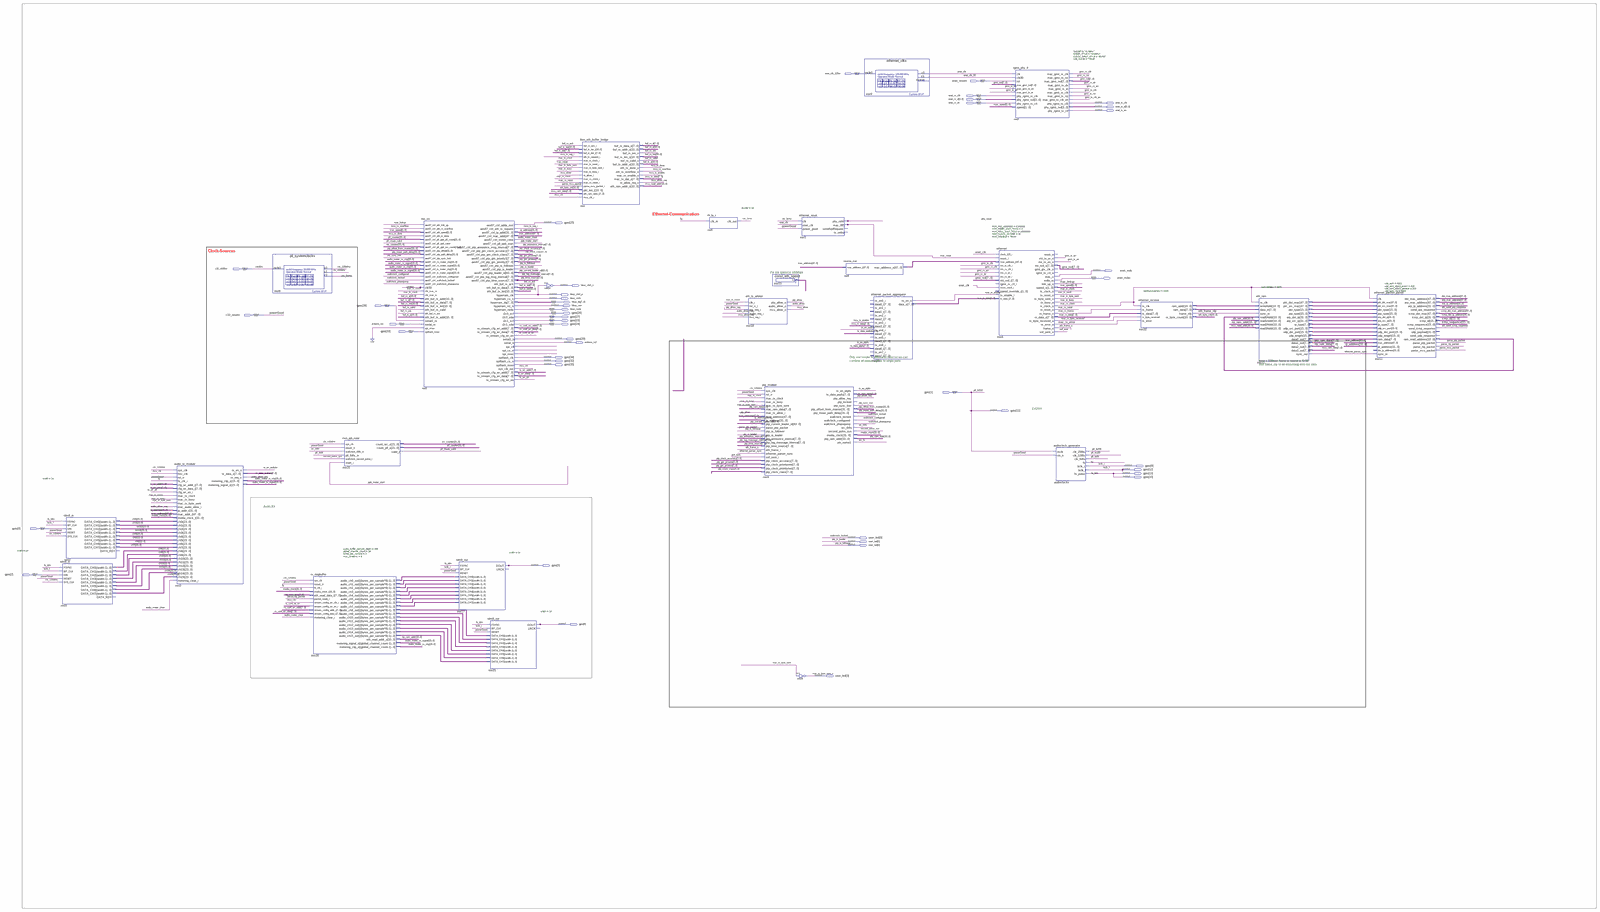
[diagram p0: schematic sheet, whole]
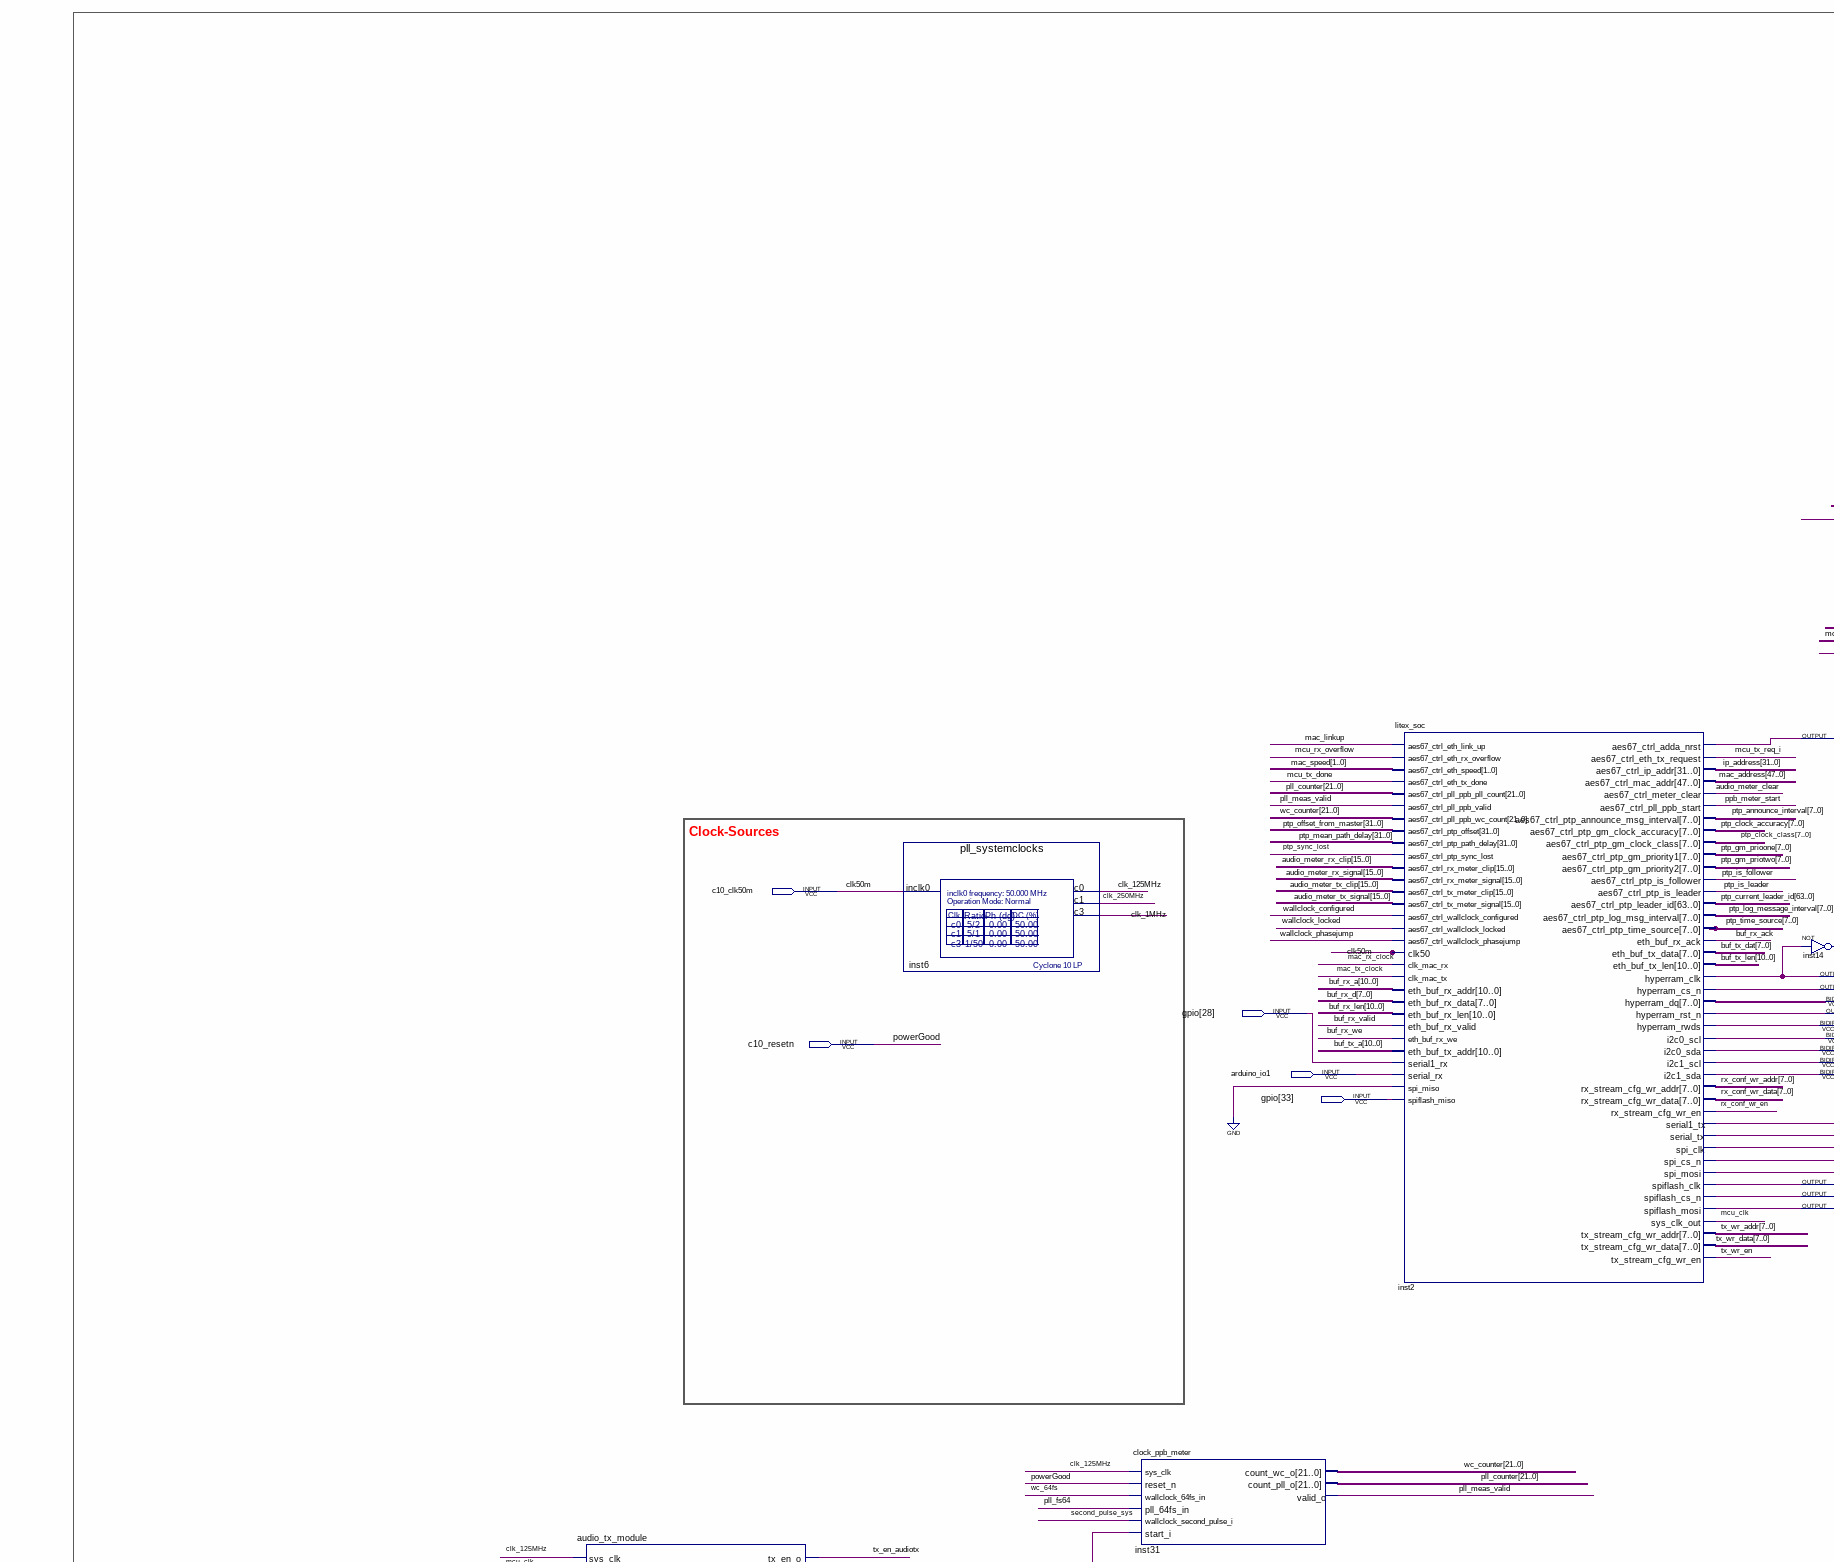
[diagram p1: schematic sheet, upper left part]
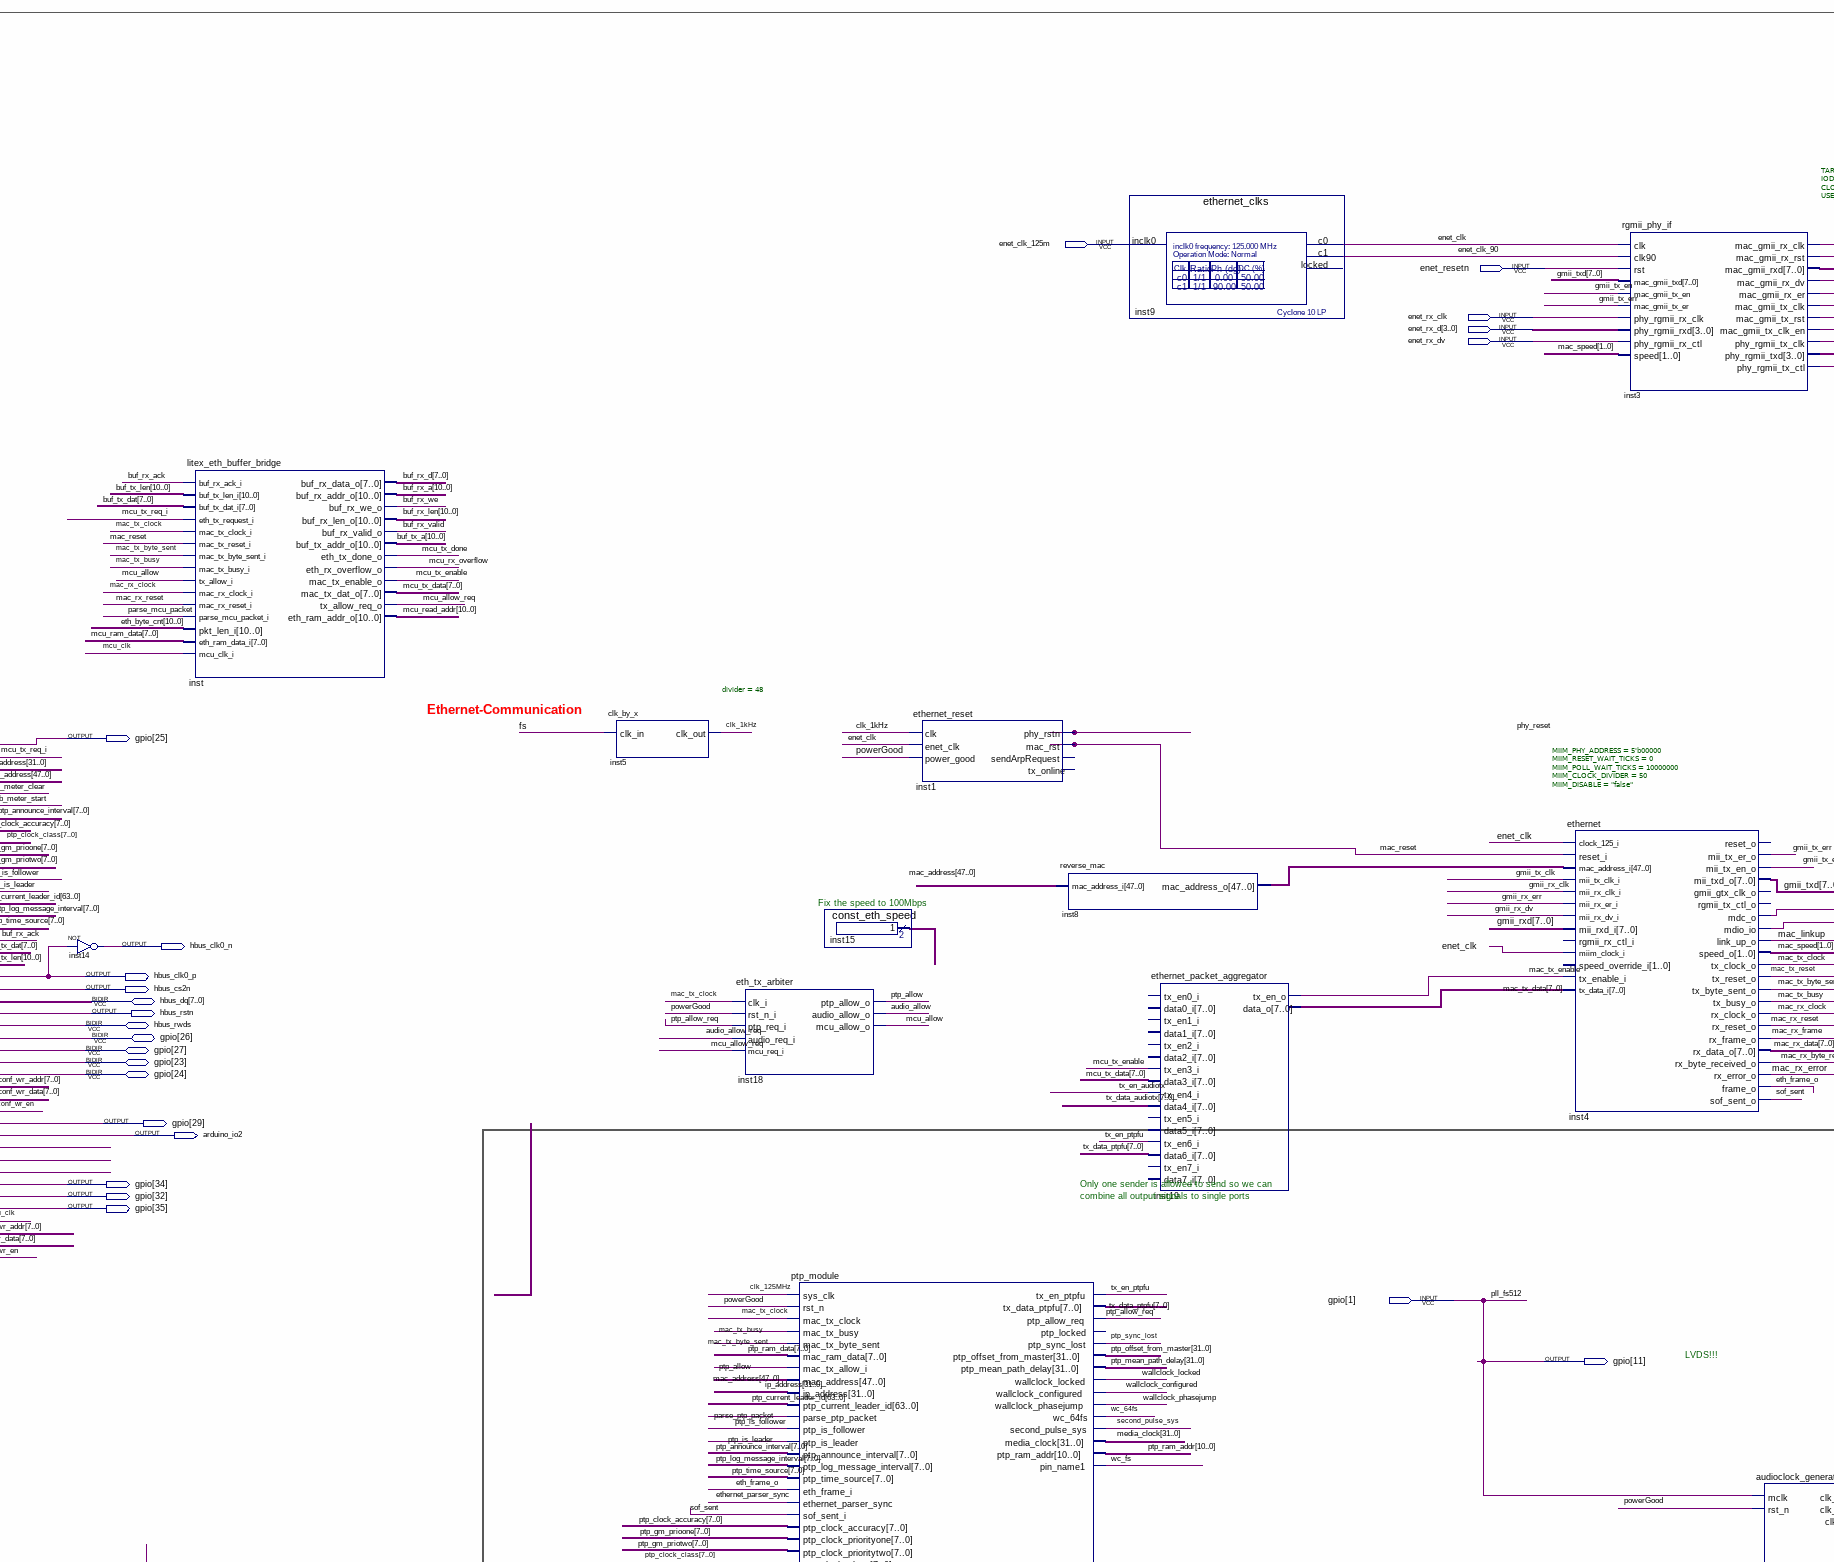
[diagram p2: schematic sheet, upper centre part]
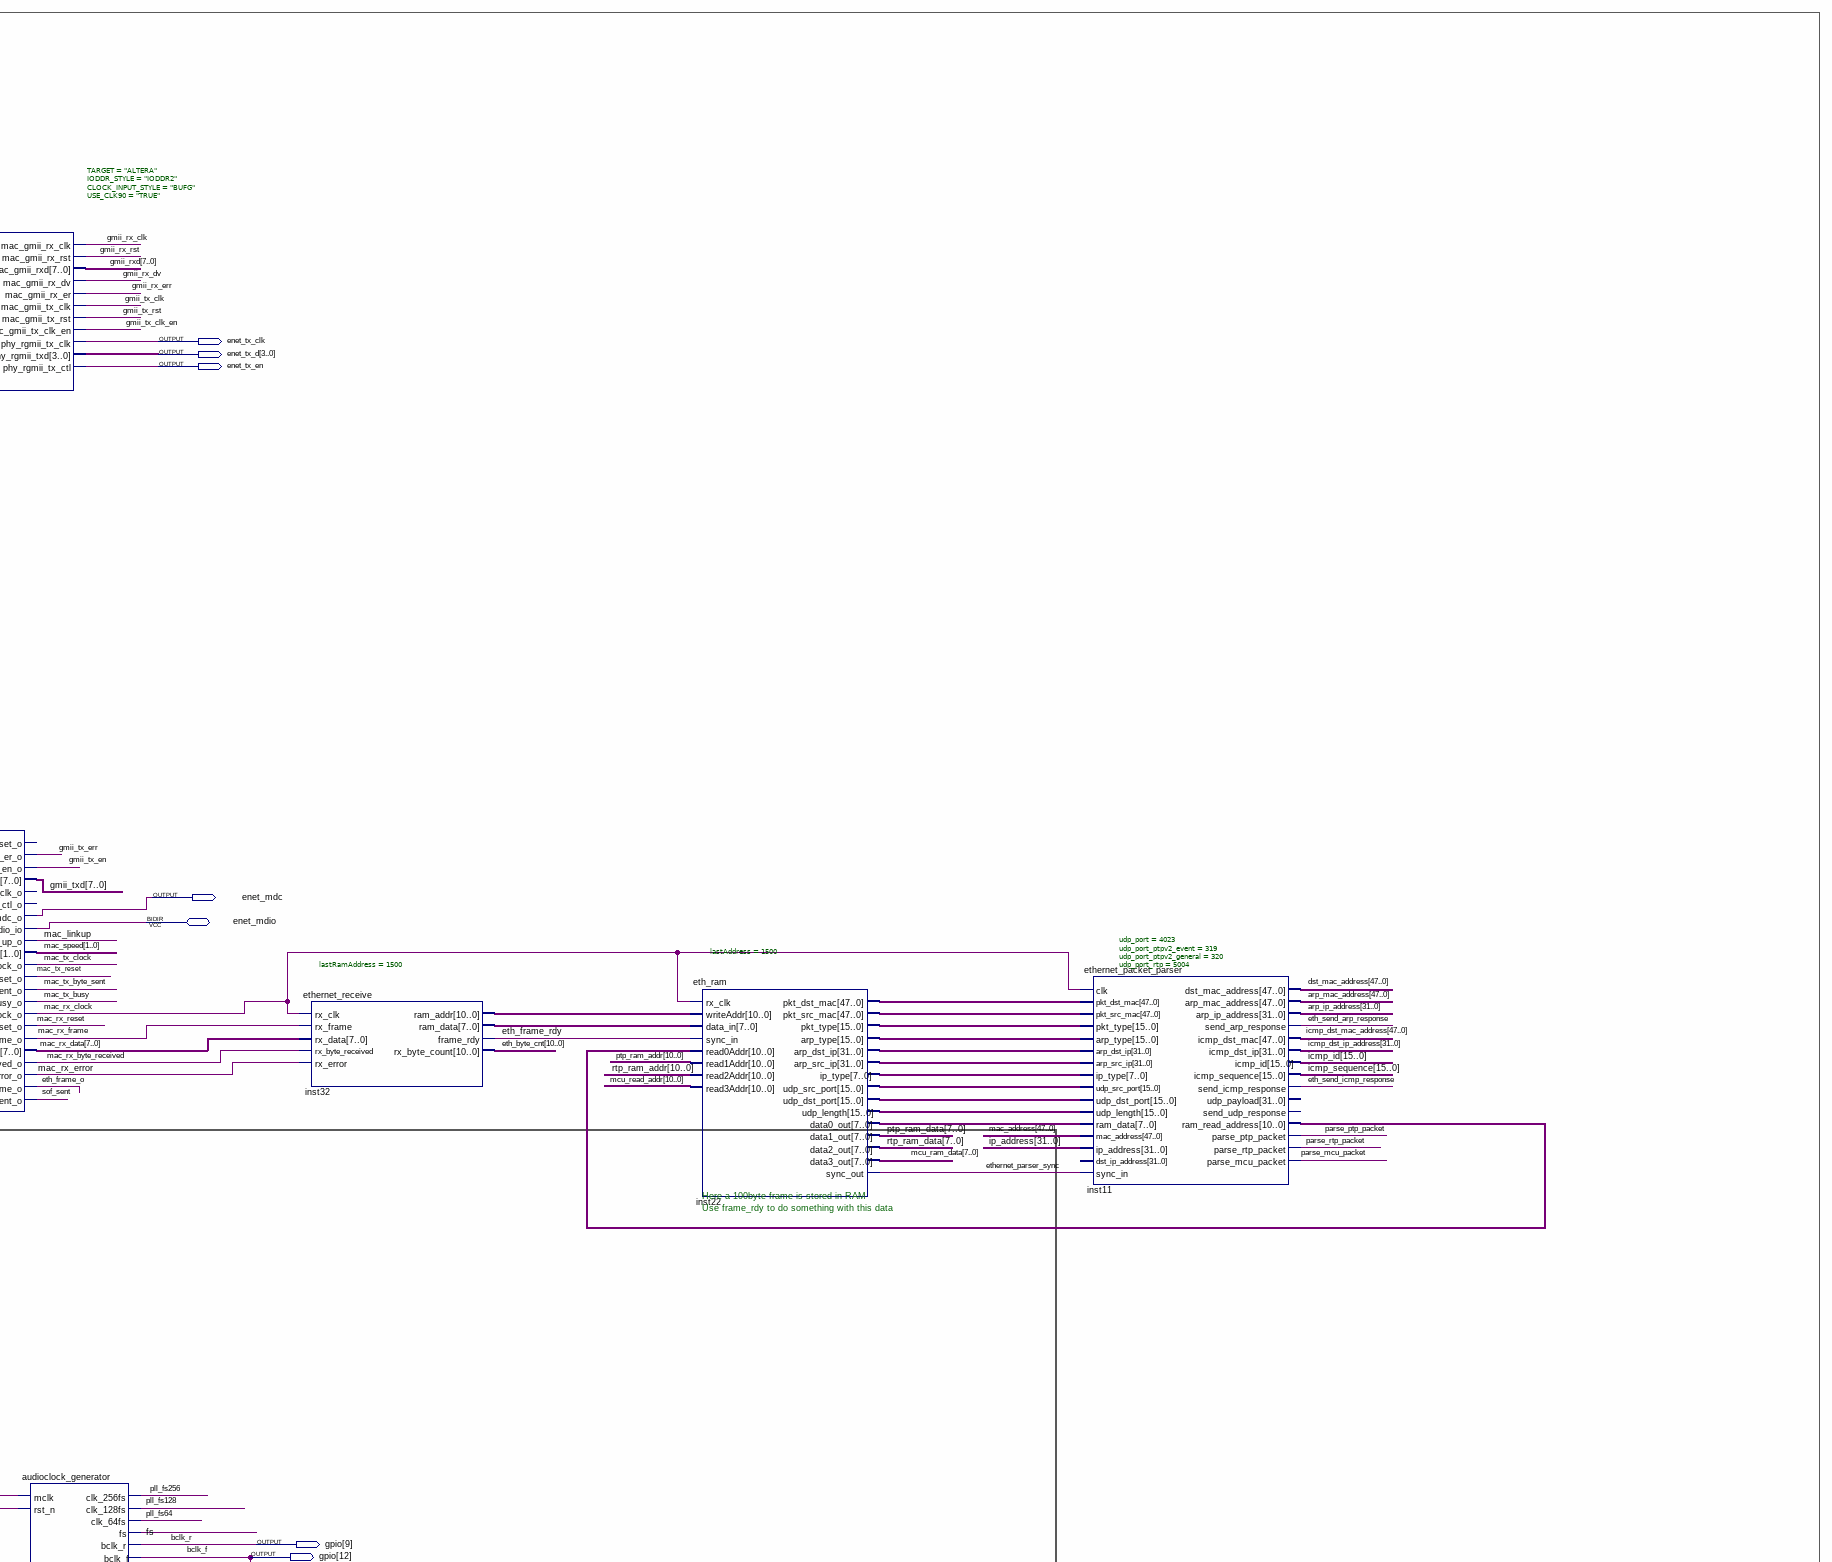
[diagram p3: schematic sheet, upper right part]
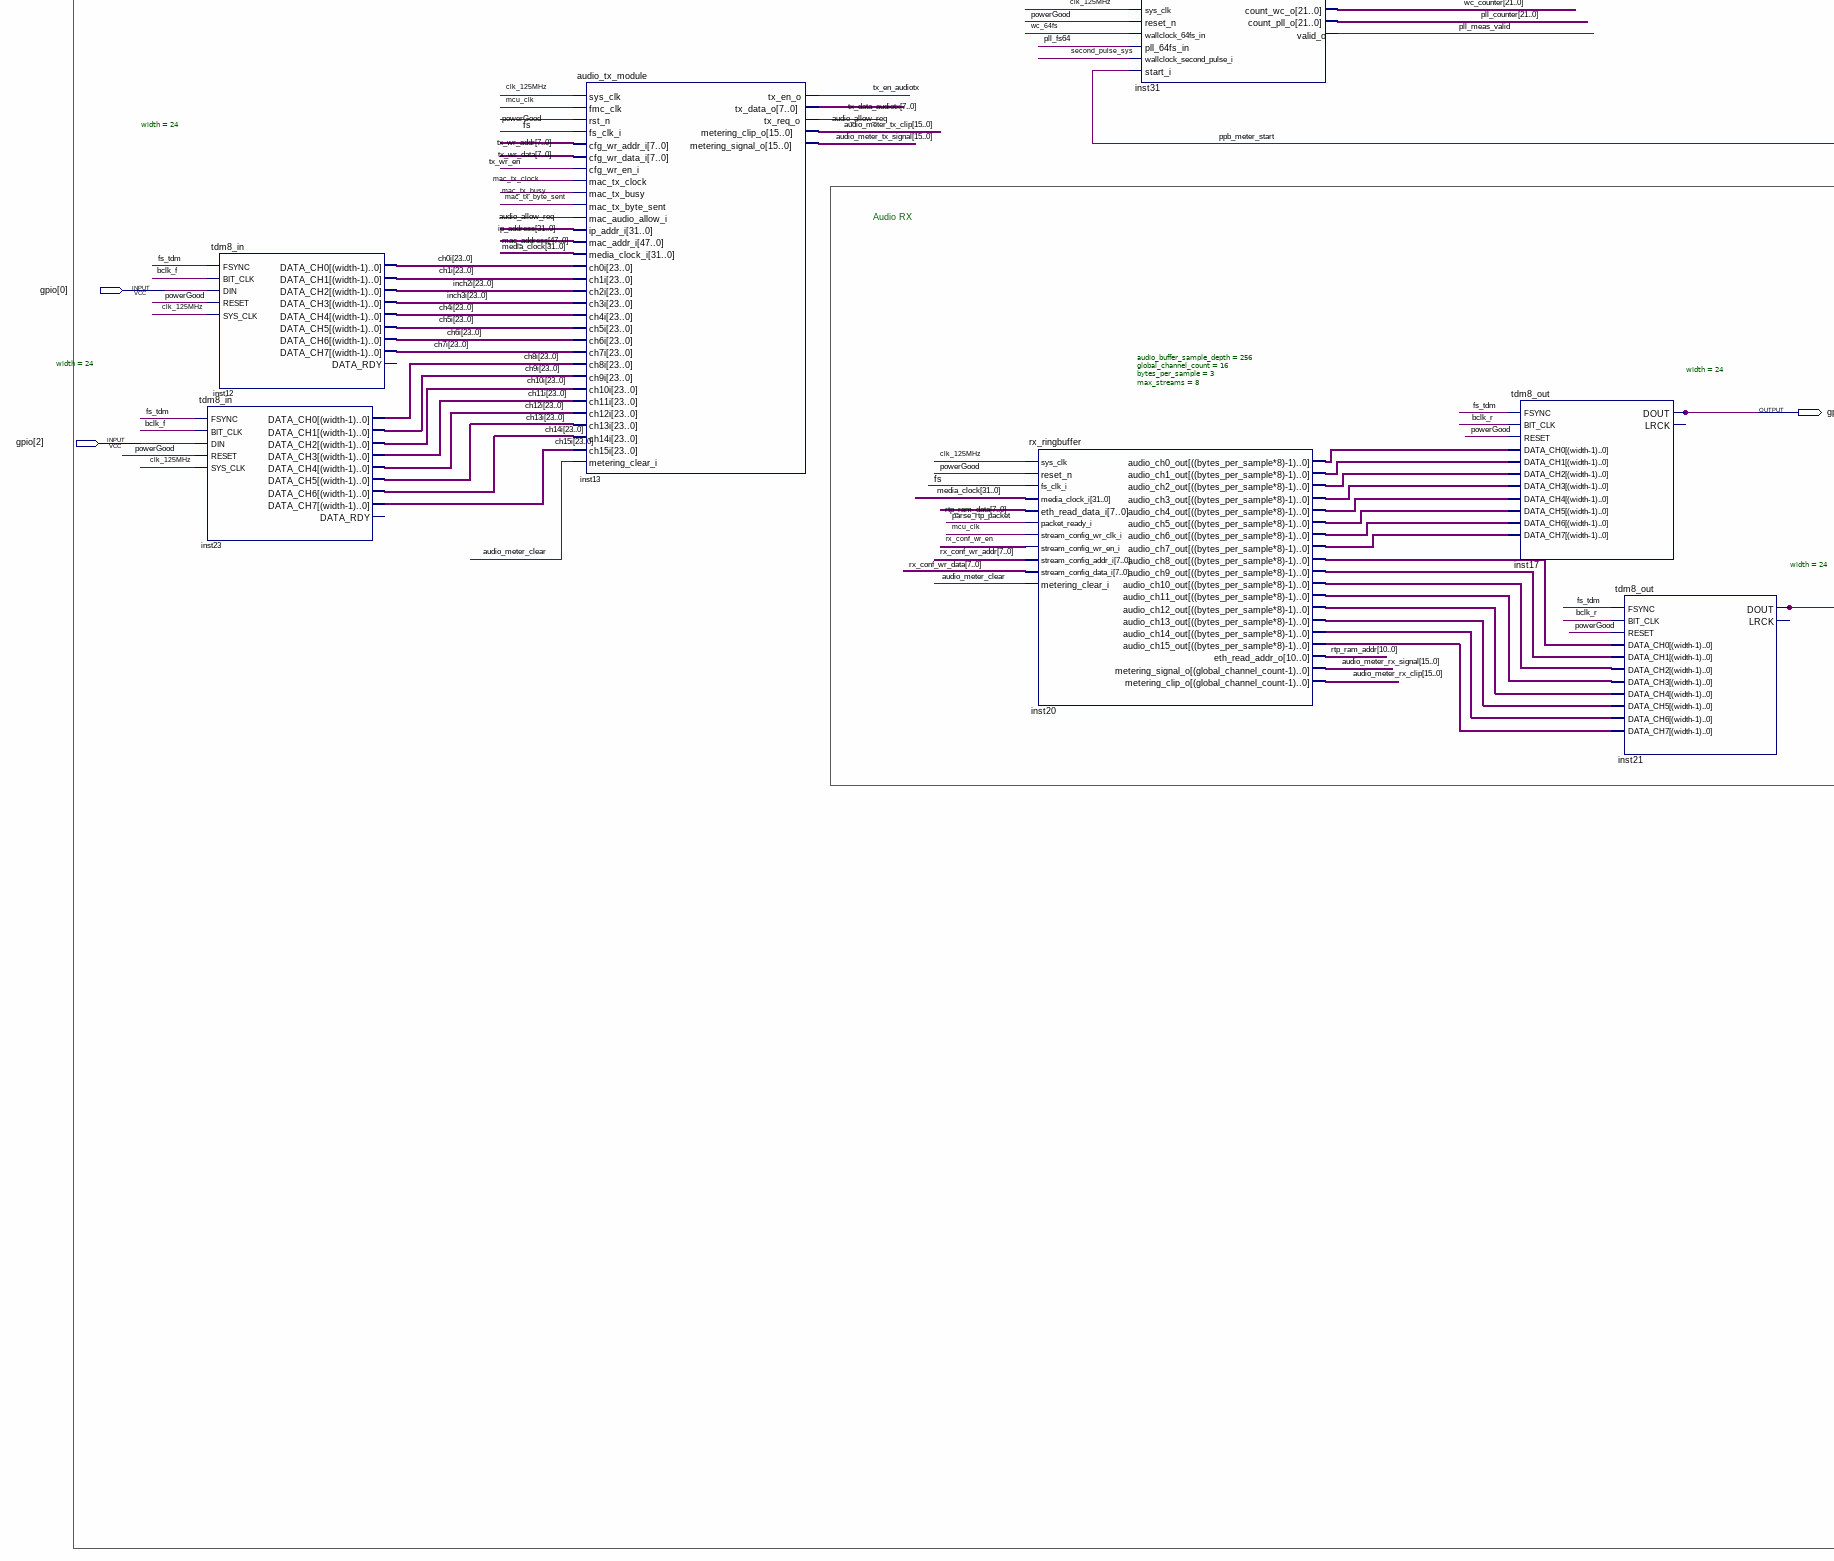
[diagram p4: schematic sheet, lower left part]
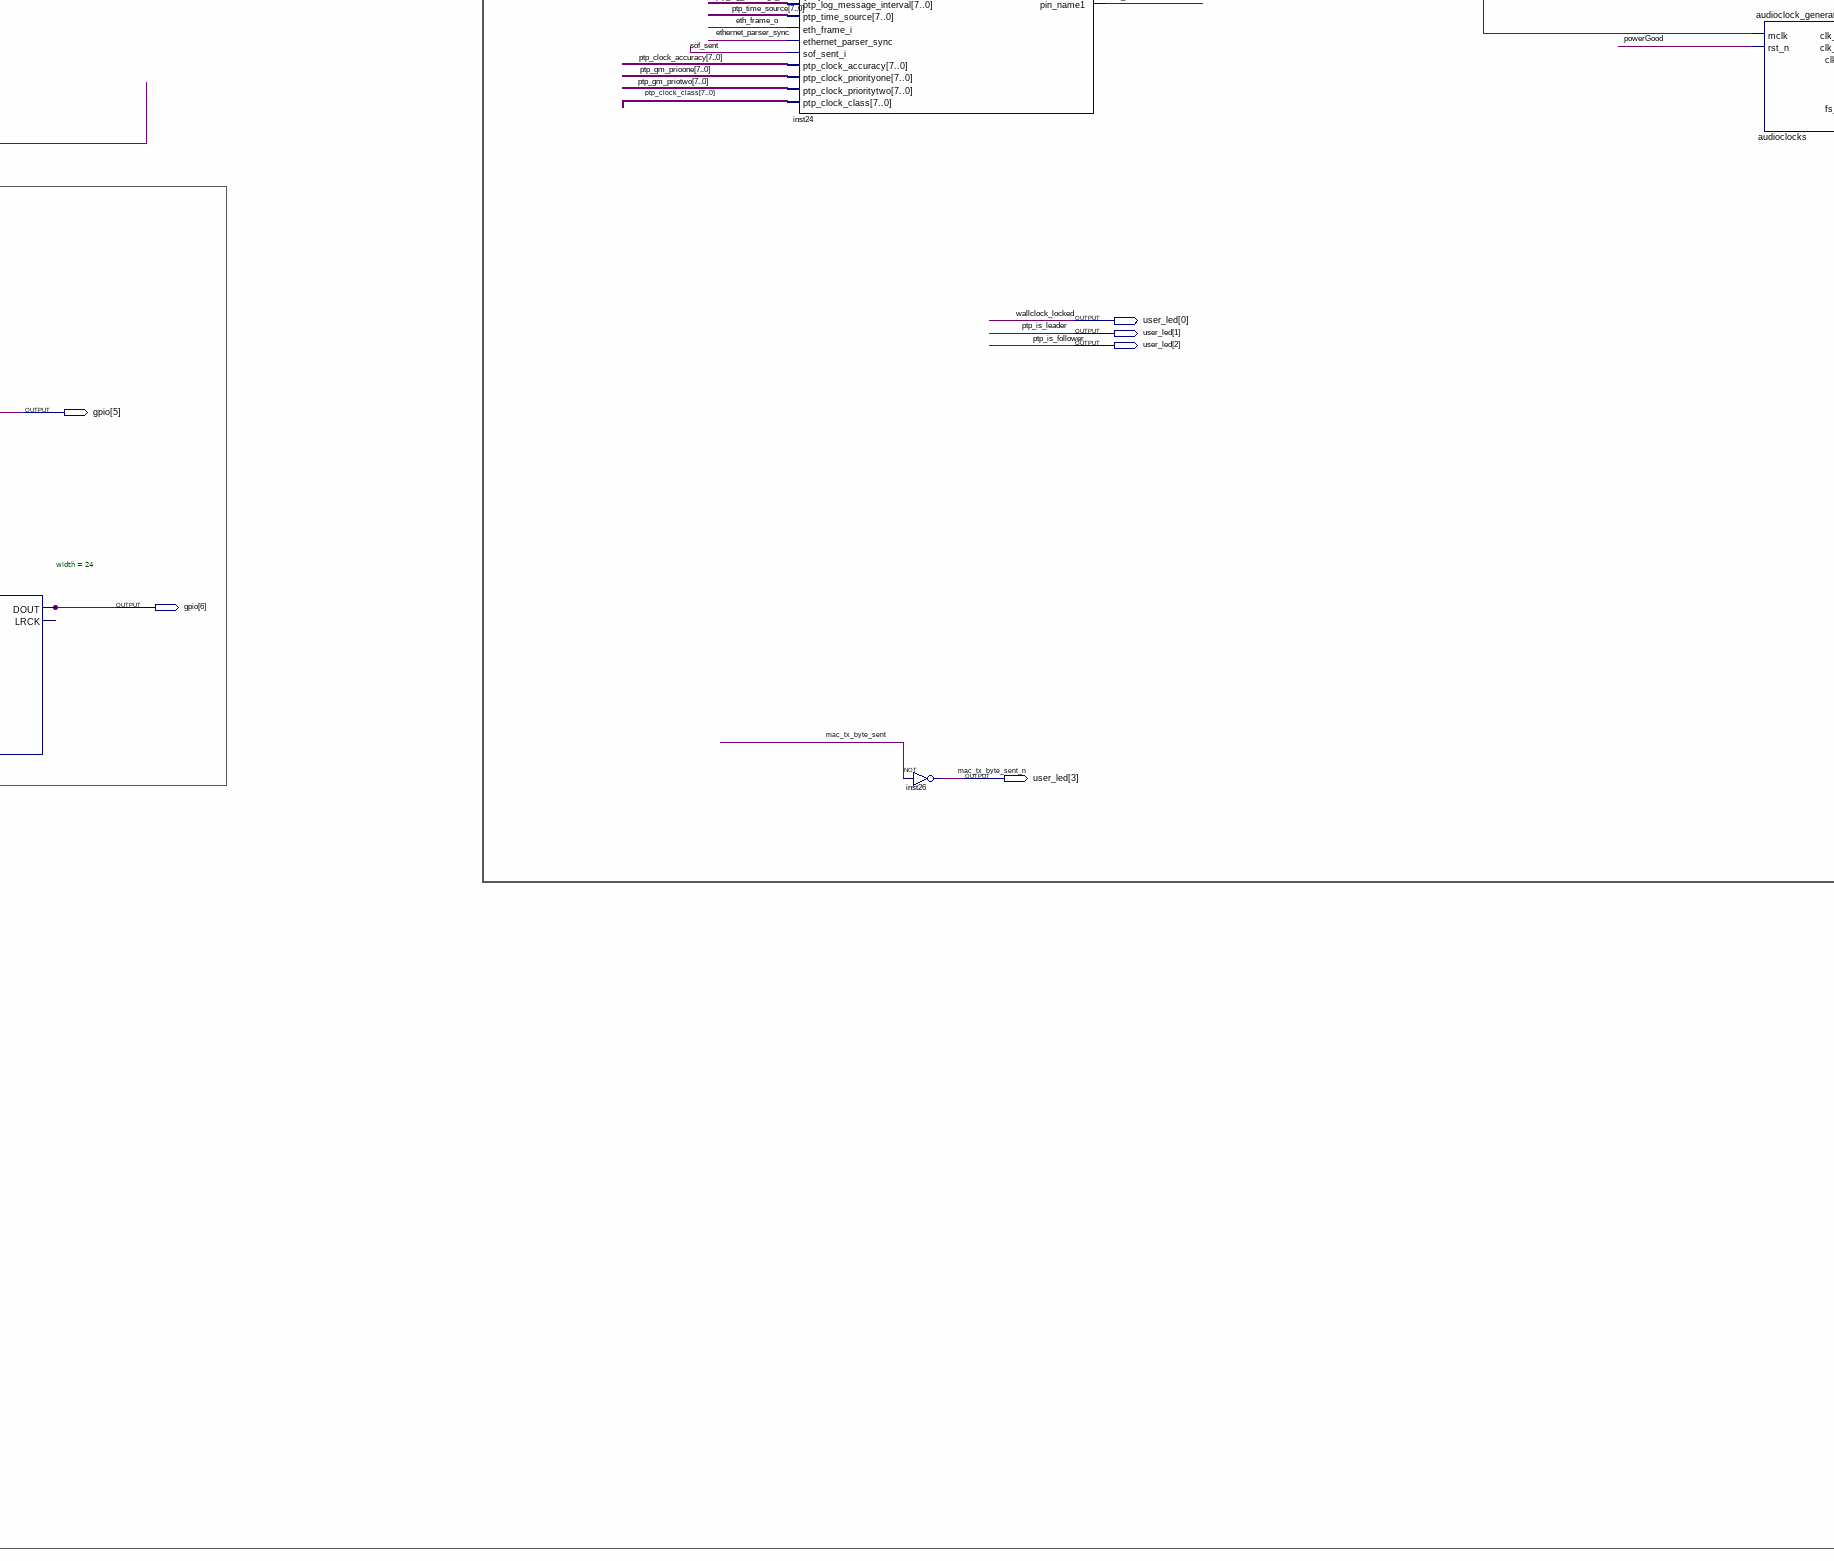
[diagram p5: schematic sheet, lower centre part]
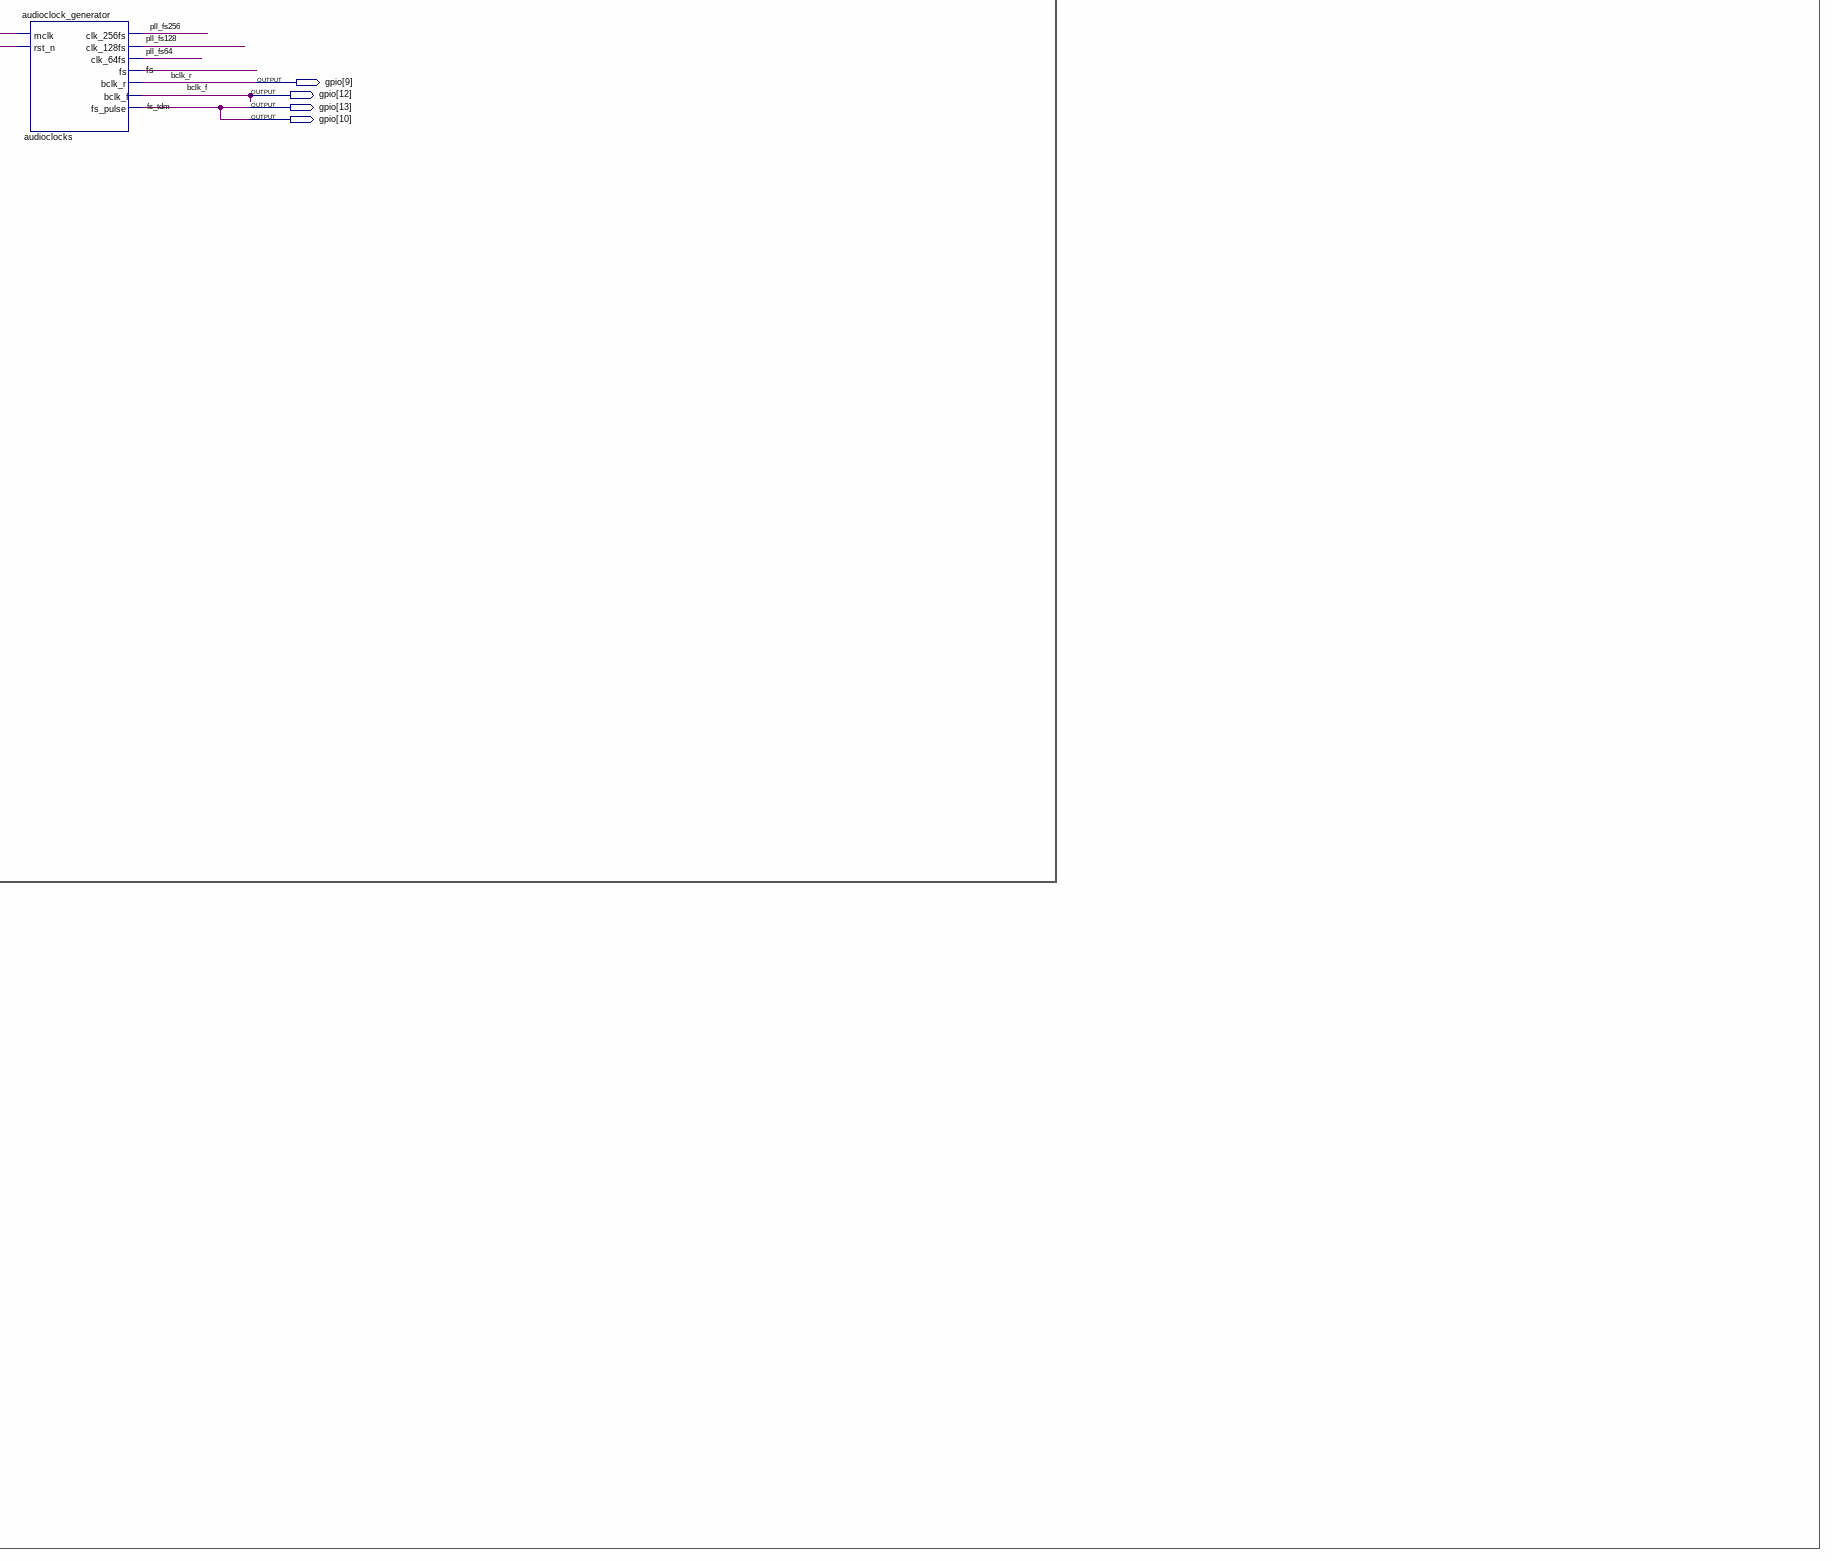
[diagram p6: schematic sheet, lower right part]
// Quartus schematic FPGA.bdf as structural Verilog: 26 symbols, 45 pins
module FPGA (
  input  enet_clk_125m,
  input  enet_resetn,
  input  enet_rx_clk,
  input  [3:0] enet_rx_d,
  input  enet_rx_dv,
  input  c10_clk50m,
  inout  [35:0] gpio,
  input  c10_resetn,
  input  arduino_io1,
  inout  enet_mdio,
  inout  [7:0] hbus_dq,
  inout  hbus_rwds,
  output enet_tx_clk,
  output [3:0] enet_tx_d,
  output enet_tx_en,
  output enet_mdc,
  output hbus_clk0_n,
  output hbus_clk0_p,
  output hbus_cs2n,
  output hbus_rstn,
  output arduino_io2,
  output [3:0] user_led
);

  wire audio_allow, audio_allow_req, audio_meter_clear, buf_rx_ack, buf_rx_valid, buf_rx_we, clk_1kHz,
       clk_1MHz, clk_125MHz, clk_250MHz, enet_clk, enet_clk_90, eth_frame_o, eth_frame_rdy,
       eth_send_arp_response, eth_send_icmp_response, ethernet_parser_sync, fs, gmii_rx_clk, gmii_rx_dv,
       gmii_rx_err, gmii_rx_rst, gmii_tx_clk, gmii_tx_clk_en, gmii_tx_en, gmii_tx_err, gmii_tx_rst,
       inst2_spi_clk, inst2_spi_cs_n, inst2_spi_mosi, mac_linkup, mac_reset, mac_rx_byte_received,
       mac_rx_clock, mac_rx_error, mac_rx_frame, mac_rx_reset, mac_tx_busy, mac_tx_byte_sent, mac_tx_clock,
       mac_tx_enable, mac_tx_reset, mcu_allow, mcu_allow_req, mcu_clk, mcu_rx_overflow, mcu_tx_done,
       mcu_tx_enable, mcu_tx_req_i, parse_mcu_packet, parse_ptp_packet, parse_rtp_packet, phy_reset,
       pll_fs64, pll_fs128, pll_fs256, pll_meas_valid, ppb_meter_start, ptp_allow, ptp_allow_req,
       ptp_sync_lost, rx_conf_wr_en, second_pulse_sys, sof_sent, tx_en_audiotx, tx_en_ptpfu, tx_wr_en,
       wallclock_configured, wallclock_phasejump, wc_64fs, wc_fs;
  wire [1:0] inst15_result, mac_speed;
  wire [7:0] buf_rx_d, buf_tx_dat, gmii_rxd, gmii_txd, inst22_data0_out, inst22_ip_type, inst32_ram_data,
       mac_rx_data, mac_tx_data, mcu_ram_data, mcu_tx_data, ptp_announce_interval, ptp_clock_accuracy,
       ptp_clock_class, ptp_gm_prioone, ptp_gm_priotwo, ptp_log_message_interval, ptp_ram_data,
       ptp_time_source, rtp_ram_data, rx_conf_wr_addr, rx_conf_wr_data, tx_data_audiotx, tx_data_ptpfu,
       tx_wr_addr, tx_wr_data;
  wire [10:0] buf_rx_a, buf_rx_len, buf_tx_a, buf_tx_len, eth_byte_cnt, inst11_ram_read_address,
       inst32_ram_addr, mcu_read_addr, ptp_ram_addr, rtp_ram_addr;
  wire [15:0] audio_meter_rx_clip, audio_meter_rx_signal, audio_meter_tx_clip, audio_meter_tx_signal,
       icmp_id, icmp_sequence, inst22_arp_type, inst22_pkt_type, inst22_udp_dst_port, inst22_udp_length,
       inst22_udp_src_port;
  wire [21:0] pll_counter, wc_counter;
  wire [23:0] ch0i, ch1i, ch4i, ch5i, ch6i, ch7i, ch8i, ch9i, ch10i, ch11i, ch12i, ch13i, ch14i, ch15i,
       inch2i, inch3i, inst20_audio_ch0_out, inst20_audio_ch1_out, inst20_audio_ch2_out,
       inst20_audio_ch3_out, inst20_audio_ch4_out, inst20_audio_ch5_out, inst20_audio_ch6_out,
       inst20_audio_ch7_out, inst20_audio_ch8_out, inst20_audio_ch9_out, inst20_audio_ch10_out,
       inst20_audio_ch11_out, inst20_audio_ch12_out, inst20_audio_ch13_out, inst20_audio_ch14_out,
       inst20_audio_ch15_out;
  wire [31:0] arp_ip_address, icmp_dst_ip_address, inst22_arp_dst_ip, inst22_arp_src_ip, ip_address,
       media_clock, ptp_mean_path_delay, ptp_offset_from_master;
  wire [47:0] arp_mac_address, dst_mac_address, icmp_dst_mac_address, inst8_mac_address_o,
       inst22_pkt_dst_mac, inst22_pkt_src_mac, mac_address;
  wire [63:0] ptp_current_leader_id;

  tdm8_in #(.width(24)) inst12 (
    .FSYNC(gpio[13]), .BIT_CLK(gpio[12]), .DIN(gpio[0]), .RESET(c10_resetn), .SYS_CLK(clk_125MHz),
    .DATA_CH0(ch0i), .DATA_CH1(ch1i), .DATA_CH2(inch2i), .DATA_CH3(inch3i), .DATA_CH4(ch4i), .DATA_CH5(ch5i),
    .DATA_CH6(ch6i), .DATA_CH7(ch7i));  // open: DATA_RDY
  tdm8_in #(.width(24)) inst23 (
    .FSYNC(gpio[13]), .BIT_CLK(gpio[12]), .DIN(gpio[2]), .RESET(c10_resetn), .SYS_CLK(clk_125MHz),
    .DATA_CH0(ch8i), .DATA_CH1(ch9i), .DATA_CH2(ch10i), .DATA_CH3(ch11i), .DATA_CH4(ch12i), .DATA_CH5(ch13i),
    .DATA_CH6(ch14i), .DATA_CH7(ch15i));  // open: DATA_RDY
  audio_tx_module inst13 (
    .sys_clk(clk_125MHz), .fmc_clk(mcu_clk), .rst_n(c10_resetn), .fs_clk_i(fs), .cfg_wr_addr_i(tx_wr_addr),
    .cfg_wr_data_i(tx_wr_data), .cfg_wr_en_i(tx_wr_en), .mac_tx_clock(mac_tx_clock),
    .mac_tx_busy(mac_tx_busy), .mac_tx_byte_sent(mac_tx_byte_sent), .mac_audio_allow_i(audio_allow_req),
    .ip_addr_i(ip_address), .mac_addr_i(mac_address), .media_clock_i(media_clock), .ch0i(ch0i), .ch1i(ch1i),
    .ch2i(inch2i), .ch3i(inch3i), .ch4i(ch4i), .ch5i(ch5i), .ch6i(ch6i), .ch7i(ch7i), .ch8i(ch8i),
    .ch9i(ch9i), .ch10i(ch10i), .ch11i(ch11i), .ch12i(ch12i), .ch13i(ch13i), .ch14i(ch14i), .ch15i(ch15i),
    .metering_clear_i(audio_meter_clear), .tx_en_o(tx_en_audiotx), .tx_data_o(tx_data_audiotx),
    .tx_req_o(audio_allow_req), .metering_clip_o(audio_meter_tx_clip),
    .metering_signal_o(audio_meter_tx_signal));
  pll_systemclocks inst6 (.inclk0(c10_clk50m), .c0(clk_125MHz), .c1(clk_250MHz), .c3(clk_1MHz));
  rx_ringbuffer #(.audio_buffer_sample_depth(256), .global_channel_count(16), .bytes_per_sample(3), .max_streams(8)) inst20 (
    .sys_clk(clk_125MHz), .reset_n(c10_resetn), .fs_clk_i(fs), .media_clock_i(media_clock),
    .eth_read_data_i(rtp_ram_data), .packet_ready_i(parse_rtp_packet), .stream_config_wr_clk_i(mcu_clk),
    .stream_config_wr_en_i(rx_conf_wr_en), .stream_config_addr_i(rx_conf_wr_addr),
    .stream_config_data_i(rx_conf_wr_data), .metering_clear_i(audio_meter_clear),
    .audio_ch0_out(inst20_audio_ch0_out), .audio_ch1_out(inst20_audio_ch1_out),
    .audio_ch2_out(inst20_audio_ch2_out), .audio_ch3_out(inst20_audio_ch3_out),
    .audio_ch4_out(inst20_audio_ch4_out), .audio_ch5_out(inst20_audio_ch5_out),
    .audio_ch6_out(inst20_audio_ch6_out), .audio_ch7_out(inst20_audio_ch7_out),
    .audio_ch8_out(inst20_audio_ch8_out), .audio_ch9_out(inst20_audio_ch9_out),
    .audio_ch10_out(inst20_audio_ch10_out), .audio_ch11_out(inst20_audio_ch11_out),
    .audio_ch12_out(inst20_audio_ch12_out), .audio_ch13_out(inst20_audio_ch13_out),
    .audio_ch14_out(inst20_audio_ch14_out), .audio_ch15_out(inst20_audio_ch15_out),
    .eth_read_addr_o(rtp_ram_addr), .metering_signal_o(audio_meter_rx_signal),
    .metering_clip_o(audio_meter_rx_clip));
  clock_ppb_meter inst31 (
    .sys_clk(clk_125MHz), .reset_n(c10_resetn), .wallclock_64fs_in(wc_64fs), .pll_64fs_in(pll_fs64),
    .wallclock_second_pulse_i(second_pulse_sys), .start_i(ppb_meter_start), .count_wc_o(wc_counter),
    .count_pll_o(pll_counter), .valid_o(pll_meas_valid));
  litex_soc inst2 (
    .aes67_ctrl_eth_link_up(mac_linkup), .aes67_ctrl_eth_rx_overflow(mcu_rx_overflow),
    .aes67_ctrl_eth_speed(mac_speed), .aes67_ctrl_eth_tx_done(mcu_tx_done),
    .aes67_ctrl_pll_ppb_pll_count(pll_counter), .aes67_ctrl_pll_ppb_valid(pll_meas_valid),
    .aes67_ctrl_pll_ppb_wc_count(wc_counter), .aes67_ctrl_ptp_offset(ptp_offset_from_master),
    .aes67_ctrl_ptp_path_delay(ptp_mean_path_delay), .aes67_ctrl_ptp_sync_lost(ptp_sync_lost),
    .aes67_ctrl_rx_meter_clip(audio_meter_rx_clip), .aes67_ctrl_rx_meter_signal(audio_meter_rx_signal),
    .aes67_ctrl_tx_meter_clip(audio_meter_tx_clip), .aes67_ctrl_tx_meter_signal(audio_meter_tx_signal),
    .aes67_ctrl_wallclock_configured(wallclock_configured), .aes67_ctrl_wallclock_locked(user_led[0]),
    .aes67_ctrl_wallclock_phasejump(wallclock_phasejump), .clk50(c10_clk50m), .clk_mac_rx(mac_rx_clock),
    .clk_mac_tx(mac_tx_clock), .eth_buf_rx_addr(buf_rx_a), .eth_buf_rx_data(buf_rx_d),
    .eth_buf_rx_len(buf_rx_len), .eth_buf_rx_valid(buf_rx_valid), .eth_buf_rx_we(buf_rx_we),
    .eth_buf_tx_addr(buf_tx_a), .serial1_rx(gpio[28]), .serial_rx(arduino_io1), .spi_miso(1'b0),
    .spiflash_miso(gpio[33]), .aes67_ctrl_adda_nrst(gpio[25]), .aes67_ctrl_eth_tx_request(mcu_tx_req_i),
    .aes67_ctrl_ip_addr(ip_address), .aes67_ctrl_mac_addr(mac_address),
    .aes67_ctrl_meter_clear(audio_meter_clear), .aes67_ctrl_pll_ppb_start(ppb_meter_start),
    .aes67_ctrl_ptp_announce_msg_interval(ptp_announce_interval),
    .aes67_ctrl_ptp_gm_clock_accuracy(ptp_clock_accuracy), .aes67_ctrl_ptp_gm_clock_class(ptp_clock_class),
    .aes67_ctrl_ptp_gm_priority1(ptp_gm_prioone), .aes67_ctrl_ptp_gm_priority2(ptp_gm_priotwo),
    .aes67_ctrl_ptp_is_follower(user_led[2]), .aes67_ctrl_ptp_is_leader(user_led[1]),
    .aes67_ctrl_ptp_leader_id(ptp_current_leader_id),
    .aes67_ctrl_ptp_log_msg_interval(ptp_log_message_interval), .aes67_ctrl_ptp_time_source(ptp_time_source),
    .eth_buf_rx_ack(buf_rx_ack), .eth_buf_tx_data(buf_tx_dat), .eth_buf_tx_len(buf_tx_len),
    .hyperram_clk(hbus_clk0_p), .hyperram_cs_n(hbus_cs2n), .hyperram_rst_n(hbus_rstn),
    .rx_stream_cfg_wr_addr(rx_conf_wr_addr), .rx_stream_cfg_wr_data(rx_conf_wr_data),
    .rx_stream_cfg_wr_en(rx_conf_wr_en), .serial1_tx(gpio[29]), .serial_tx(arduino_io2),
    .spi_clk(inst2_spi_clk), .spi_cs_n(inst2_spi_cs_n), .spi_mosi(inst2_spi_mosi), .spiflash_clk(gpio[34]),
    .spiflash_cs_n(gpio[32]), .spiflash_mosi(gpio[35]), .sys_clk_out(mcu_clk),
    .tx_stream_cfg_wr_addr(tx_wr_addr), .tx_stream_cfg_wr_data(tx_wr_data), .tx_stream_cfg_wr_en(tx_wr_en),
    .hyperram_dq(hbus_dq), .hyperram_rwds(hbus_rwds), .i2c0_scl(gpio[26]), .i2c0_sda(gpio[27]),
    .i2c1_scl(gpio[23]), .i2c1_sda(gpio[24]));
  tdm8_out #(.width(24)) inst17 (
    .FSYNC(gpio[13]), .BIT_CLK(gpio[9]), .RESET(c10_resetn), .DATA_CH0(inst20_audio_ch0_out),
    .DATA_CH1(inst20_audio_ch1_out), .DATA_CH2(inst20_audio_ch2_out), .DATA_CH3(inst20_audio_ch3_out),
    .DATA_CH4(inst20_audio_ch4_out), .DATA_CH5(inst20_audio_ch5_out), .DATA_CH6(inst20_audio_ch6_out),
    .DATA_CH7(inst20_audio_ch7_out), .DOUT(gpio[5]));  // open: LRCK
  tdm8_out #(.width(24)) inst21 (
    .FSYNC(gpio[13]), .BIT_CLK(gpio[9]), .RESET(c10_resetn), .DATA_CH0(inst20_audio_ch8_out),
    .DATA_CH1(inst20_audio_ch9_out), .DATA_CH2(inst20_audio_ch10_out), .DATA_CH3(inst20_audio_ch11_out),
    .DATA_CH4(inst20_audio_ch12_out), .DATA_CH5(inst20_audio_ch13_out), .DATA_CH6(inst20_audio_ch14_out),
    .DATA_CH7(inst20_audio_ch15_out), .DOUT(gpio[6]));  // open: LRCK
  not inst14 (hbus_clk0_n, hbus_clk0_p);
  litex_eth_buffer_bridge inst (
    .buf_rx_ack_i(buf_rx_ack), .buf_tx_len_i(buf_tx_len), .buf_tx_dat_i(buf_tx_dat),
    .eth_tx_request_i(mcu_tx_req_i), .mac_tx_clock_i(mac_tx_clock), .mac_tx_reset_i(mac_reset),
    .mac_tx_byte_sent_i(mac_tx_byte_sent), .mac_tx_busy_i(mac_tx_busy), .tx_allow_i(mcu_allow),
    .mac_rx_clock_i(mac_rx_clock), .mac_rx_reset_i(mac_rx_reset), .parse_mcu_packet_i(parse_mcu_packet),
    .pkt_len_i(eth_byte_cnt), .eth_ram_data_i(mcu_ram_data), .mcu_clk_i(mcu_clk), .buf_rx_data_o(buf_rx_d),
    .buf_rx_addr_o(buf_rx_a), .buf_rx_we_o(buf_rx_we), .buf_rx_len_o(buf_rx_len),
    .buf_rx_valid_o(buf_rx_valid), .buf_tx_addr_o(buf_tx_a), .eth_tx_done_o(mcu_tx_done),
    .eth_rx_overflow_o(mcu_rx_overflow), .mac_tx_enable_o(mcu_tx_enable), .mac_tx_dat_o(mcu_tx_data),
    .tx_allow_req_o(mcu_allow_req), .eth_ram_addr_o(mcu_read_addr));
  clk_by_x #(.divider(48)) inst5 (.clk_in(fs), .clk_out(clk_1kHz));
  eth_tx_arbiter inst18 (
    .clk_i(mac_tx_clock), .rst_n_i(c10_resetn), .ptp_req_i(ptp_allow_req), .audio_req_i(audio_allow_req),
    .mcu_req_i(mcu_allow_req), .ptp_allow_o(ptp_allow), .audio_allow_o(audio_allow), .mcu_allow_o(mcu_allow));
  ptp_module inst24 (
    .sys_clk(clk_125MHz), .rst_n(c10_resetn), .mac_tx_clock(mac_tx_clock), .mac_tx_busy(mac_tx_busy),
    .mac_tx_byte_sent(mac_tx_byte_sent), .mac_ram_data(ptp_ram_data), .mac_tx_allow_i(ptp_allow),
    .mac_address(mac_address), .ip_address(ip_address), .ptp_current_leader_id(ptp_current_leader_id),
    .parse_ptp_packet(parse_ptp_packet), .ptp_is_follower(user_led[2]), .ptp_is_leader(user_led[1]),
    .ptp_announce_interval(ptp_announce_interval), .ptp_log_message_interval(ptp_log_message_interval),
    .ptp_time_source(ptp_time_source), .eth_frame_i(eth_frame_o),
    .ethernet_parser_sync(ethernet_parser_sync), .sof_sent_i(sof_sent),
    .ptp_clock_accuracy(ptp_clock_accuracy), .ptp_clock_priorityone(ptp_gm_prioone),
    .ptp_clock_prioritytwo(ptp_gm_priotwo), .ptp_clock_class(ptp_clock_class), .tx_en_ptpfu(tx_en_ptpfu),
    .tx_data_ptpfu(tx_data_ptpfu), .ptp_allow_req(ptp_allow_req), .ptp_sync_lost(ptp_sync_lost),
    .ptp_offset_from_master(ptp_offset_from_master), .ptp_mean_path_delay(ptp_mean_path_delay),
    .wallclock_locked(user_led[0]), .wallclock_configured(wallclock_configured),
    .wallclock_phasejump(wallclock_phasejump), .wc_64fs(wc_64fs), .second_pulse_sys(second_pulse_sys),
    .media_clock(media_clock), .ptp_ram_addr(ptp_ram_addr), .pin_name1(wc_fs));  // open: ptp_locked
  const_eth_speed inst15 (.result(inst15_result));
  ethernet_reset inst1 (
    .clk(clk_1kHz), .enet_clk(enet_clk), .power_good(c10_resetn), .phy_rstn(phy_reset), .mac_rst(mac_reset));  // open: sendArpRequest, tx_online
  not inst26 (user_led[3], mac_tx_byte_sent);
  reverse_mac inst8 (.mac_address_i(mac_address), .mac_address_o(inst8_mac_address_o));
  ethernet_clks inst9 (.inclk0(enet_clk_125m), .c0(enet_clk), .c1(enet_clk_90));  // open: locked
  ethernet_packet_aggregator inst19 (
    .tx_en3_i(mcu_tx_enable), .data3_i(mcu_tx_data), .tx_en4_i(tx_en_audiotx), .data4_i(tx_data_audiotx),
    .tx_en6_i(tx_en_ptpfu), .data6_i(tx_data_ptpfu), .tx_en_o(mac_tx_enable), .data_o(mac_tx_data));  // open: tx_en0_i, data0_i, tx_en1_i, data1_i, tx_en2_i, data2_i, tx_en5_i, data5_i, tx_en7_i, data7_i
  ethernet #(.MIIM_PHY_ADDRESS(5'b00000), .MIIM_RESET_WAIT_TICKS(0), .MIIM_POLL_WAIT_TICKS(10000000), .MIIM_CLOCK_DIVIDER(50), .MIIM_DISABLE("false")) inst4 (
    .clock_125_i(enet_clk), .reset_i(mac_reset), .mac_address_i(inst8_mac_address_o),
    .mii_tx_clk_i(gmii_tx_clk), .mii_rx_clk_i(gmii_rx_clk), .mii_rx_er_i(gmii_rx_err),
    .mii_rx_dv_i(gmii_rx_dv), .mii_rxd_i(gmii_rxd), .miim_clock_i(enet_clk), .tx_enable_i(mac_tx_enable),
    .tx_data_i(mac_tx_data), .mii_tx_er_o(gmii_tx_err), .mii_tx_en_o(gmii_tx_en), .mii_txd_o(gmii_txd),
    .mdc_o(enet_mdc), .link_up_o(mac_linkup), .speed_o(mac_speed), .tx_clock_o(mac_tx_clock),
    .tx_reset_o(mac_tx_reset), .tx_byte_sent_o(mac_tx_byte_sent), .tx_busy_o(mac_tx_busy),
    .rx_clock_o(mac_rx_clock), .rx_reset_o(mac_rx_reset), .rx_frame_o(mac_rx_frame), .rx_data_o(mac_rx_data),
    .rx_byte_received_o(mac_rx_byte_received), .rx_error_o(mac_rx_error), .frame_o(eth_frame_o),
    .sof_sent_o(sof_sent), .mdio_io(enet_mdio));  // open: rgmii_rx_ctl_i, speed_override_i, reset_o, gmii_gtx_clk_o, rgmii_tx_ctl_o
  rgmii_phy_if #(.TARGET("ALTERA"), .IODDR_STYLE("IODDR2"), .CLOCK_INPUT_STYLE("BUFG"), .USE_CLK90("TRUE")) inst3 (
    .clk(enet_clk), .clk90(enet_clk_90), .rst(enet_resetn), .mac_gmii_txd(gmii_txd),
    .mac_gmii_tx_en(gmii_tx_en), .mac_gmii_tx_er(gmii_tx_err), .phy_rgmii_rx_clk(enet_rx_clk),
    .phy_rgmii_rxd(enet_rx_d), .phy_rgmii_rx_ctl(enet_rx_dv), .speed(mac_speed),
    .mac_gmii_rx_clk(gmii_rx_clk), .mac_gmii_rx_rst(gmii_rx_rst), .mac_gmii_rxd(gmii_rxd),
    .mac_gmii_rx_dv(gmii_rx_dv), .mac_gmii_rx_er(gmii_rx_err), .mac_gmii_tx_clk(gmii_tx_clk),
    .mac_gmii_tx_rst(gmii_tx_rst), .mac_gmii_tx_clk_en(gmii_tx_clk_en), .phy_rgmii_tx_clk(enet_tx_clk),
    .phy_rgmii_txd(enet_tx_d), .phy_rgmii_tx_ctl(enet_tx_en));
  audioclock_generator audioclocks (
    .mclk(gpio[1]), .rst_n(c10_resetn), .clk_256fs(pll_fs256), .clk_128fs(pll_fs128), .clk_64fs(pll_fs64),
    .fs(fs), .bclk_r(gpio[9]), .bclk_f(gpio[12]), .fs_pulse(gpio[13]));
  ethernet_receive #(.lastRamAddress(1500)) inst32 (
    .rx_clk(mac_rx_clock), .rx_frame(mac_rx_frame), .rx_data(mac_rx_data),
    .rx_byte_received(mac_rx_byte_received), .rx_error(mac_rx_error), .ram_addr(inst32_ram_addr),
    .ram_data(inst32_ram_data), .frame_rdy(eth_frame_rdy), .rx_byte_count(eth_byte_cnt));
  eth_ram #(.lastAddress(1500)) inst22 (
    .rx_clk(mac_rx_clock), .writeAddr(inst32_ram_addr), .data_in(inst32_ram_data), .sync_in(eth_frame_rdy),
    .read0Addr(inst11_ram_read_address), .read1Addr(ptp_ram_addr), .read2Addr(rtp_ram_addr),
    .read3Addr(mcu_read_addr), .pkt_dst_mac(inst22_pkt_dst_mac), .pkt_src_mac(inst22_pkt_src_mac),
    .pkt_type(inst22_pkt_type), .arp_type(inst22_arp_type), .arp_dst_ip(inst22_arp_dst_ip),
    .arp_src_ip(inst22_arp_src_ip), .ip_type(inst22_ip_type), .udp_src_port(inst22_udp_src_port),
    .udp_dst_port(inst22_udp_dst_port), .udp_length(inst22_udp_length), .data0_out(inst22_data0_out),
    .data1_out(ptp_ram_data), .data2_out(rtp_ram_data), .data3_out(mcu_ram_data),
    .sync_out(ethernet_parser_sync));
  ethernet_packet_parser #(.udp_port(4023), .udp_port_ptpv2_event(319), .udp_port_ptpv2_general(320), .udp_port_rtp(5004)) inst11 (
    .clk(mac_rx_clock), .pkt_dst_mac(inst22_pkt_dst_mac), .pkt_src_mac(inst22_pkt_src_mac),
    .pkt_type(inst22_pkt_type), .arp_type(inst22_arp_type), .arp_dst_ip(inst22_arp_dst_ip),
    .arp_src_ip(inst22_arp_src_ip), .ip_type(inst22_ip_type), .udp_src_port(inst22_udp_src_port),
    .udp_dst_port(inst22_udp_dst_port), .udp_length(inst22_udp_length), .ram_data(inst22_data0_out),
    .mac_address(mac_address), .ip_address(ip_address), .sync_in(ethernet_parser_sync),
    .dst_mac_address(dst_mac_address), .arp_mac_address(arp_mac_address), .arp_ip_address(arp_ip_address),
    .send_arp_response(eth_send_arp_response), .icmp_dst_mac(icmp_dst_mac_address),
    .icmp_dst_ip(icmp_dst_ip_address), .icmp_id(icmp_id), .icmp_sequence(icmp_sequence),
    .send_icmp_response(eth_send_icmp_response), .ram_read_address(inst11_ram_read_address),
    .parse_ptp_packet(parse_ptp_packet), .parse_rtp_packet(parse_rtp_packet),
    .parse_mcu_packet(parse_mcu_packet));  // open: dst_ip_address, udp_payload, send_udp_response

  assign gpio[11:10] = {gpio[1], gpio[13]};

  // Other names for the same wires on the sheet: bclk_r = gpio[9]; clk50m = c10_clk50m; fs_tdm = gpio[13];
  //   pll_fs512 = gpio[1]; bclk_f = gpio[12]; mac_tx_byte_sent_n = user_led[3]; powerGood = c10_resetn;
  //   ptp_is_follower = user_led[2]; ptp_is_leader = user_led[1]; wallclock_locked = user_led[0]

  // Notes on the sheet:
  //   Ethernet-Communication
  //   Clock-Sources
  //   Fix the speed to 100Mbps
  //   Only one sender is allowed to send so we can
  //   combine all output signals to single ports
  //   Here a 100byte frame is stored in RAM
  //   Use frame_rdy to do something with this data
  //   LVDS!!!
  //   Audio RX
endmodule
